# EAGLE design roboskin_distance_IMU_WIFI (EAGLE 9.6.2)
COMPANY: ADAFRUIT INDUSTRIES; DRAWN: KTOWN; REV: B
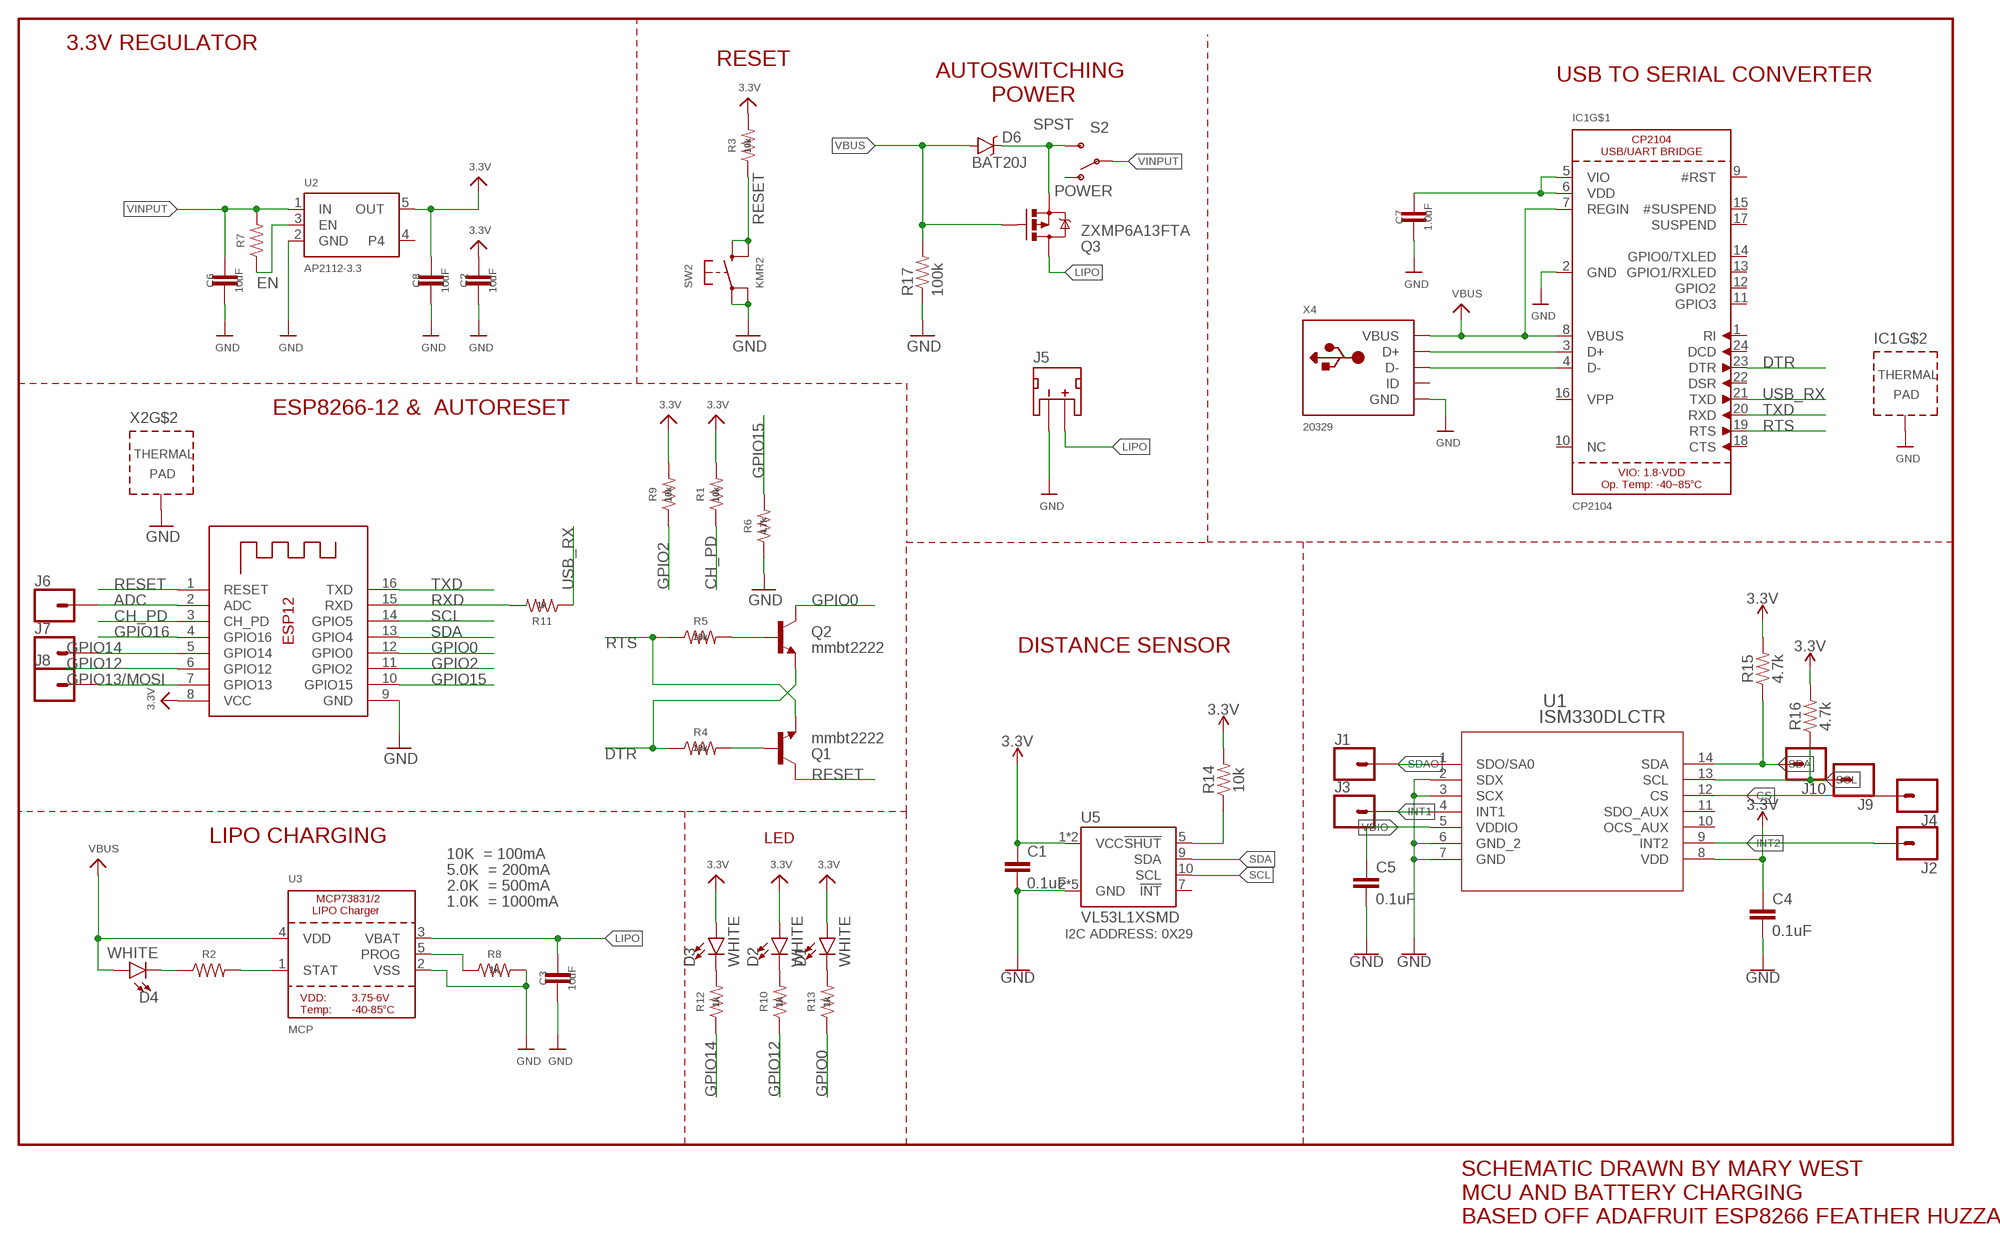
[diagram p0: schematic, sheet 1]

## Parts
C1  0.1uF  0.1UF-0603-25V-(+80/-20%)  [0603]
C2  10uF  10UF-0805-10V-10%  [0805]
C3  10uF  10UF-0805-10V-10%  [0805]
C4  0.1uF  0.1UF-0603-25V-(+80/-20%)  [0603]
C5  0.1uF  0.1UF-0603-25V-(+80/-20%)  [0603]
C6  10uF  10UF-0805-10V-10%  [0805]
C7  1.0uF  1.0UF-0603-16V-10%  [0603]
C8  10uF  10UF-0805-10V-10%  [0805]
D1  WHITE  LED-WHITE1206  [LED-1206]
D2  WHITE  LED-WHITE1206  [LED-1206]
D3  WHITE  LED-WHITE1206  [LED-1206]
D4  WHITE  LED-WHITE1206  [LED-1206]
D6  BAT20J  DIODE-SCHOTTKY-BAT20J  [SOD-323]
IC1  CP2104  [QFN24_4MM_SMSC]
J1  CONN_01  [1X01]
J2  CONN_01  [1X01]
J3  CONN_01  [1X01]
J4  CONN_01  [1X01]
J5  JST_2MM_MALE  [JST-2-SMD]
J6  CONN_01  [1X01]
J7  CONN_01  [1X01]
J8  CONN_01  [1X01]
J9  CONN_01  [1X01]
J10  CONN_01  [1X01]
Q1  mmbt2222  TRANSISTOR_NPNSOT23-3  [SOT23-3]
Q2  mmbt2222  TRANSISTOR_NPNSOT23-3  [SOT23-3]
Q3  ZXMP6A13FTA  MOSFET-PCHANNEL  [SOT23-3]
R1  10k  10KOHM-0603-1/10W-1%  [0603]
R2  1k  1KOHM-0603-1/10W-1%  [0603]
R3  10k  10KOHM-0603-1/10W-1%  [0603]
R4  10k  10KOHM-0603-1/10W-1%  [0603]
R5  10k  10KOHM-0603-1/10W-1%  [0603]
R6  4.7k  4.7KOHM-0603-1/10W-1%  [0603]
R7  10k  10KOHM-0603-1/10W-1%  [0603]
R8  1k  1KOHM-0603-1/10W-1%  [0603]
R9  10k  10KOHM-0603-1/10W-1%  [0603]
R10  1k  1KOHM-0603-1/10W-1%  [0603]
R11  1k  1KOHM-0603-1/10W-1%  [0603]
R12  1k  1KOHM-0603-1/10W-1%  [0603]
R13  1k  1KOHM-0603-1/10W-1%  [0603]
R14  10k  10KOHM-0603-1/10W-1%  [0603]
R15  4.7k  4.7KOHM-0603-1/10W-1%  [0603]
R16  4.7k  4.7KOHM-0603-1/10W-1%  [0603]
R17  100k  100KOHM-1/10W-1%(0603)  [0603-RES]
S2  POWER  SWITCH-SPDT-SMD-A  [SWITCH-SPST-SMD-A]
SW2  KMR2  SWITCH_TACT_SMT4.6X2.8  [BTN_KMR2_4.6X2.8]
U1  ISM330DLCTR  [LGA-14L_2P5X3X0P83_STM]
U2  AP2112-3.3  VREG_SOT23-5  [SOT23-5]
U3  MCP  MCP73831/2  [SOT23-5]
U5  VL53L1XSMD  [VL53L1X]
X2  ESP-12  ESP-12S  [ESP-12S]
X4  20329  USB_MICRO_20329_V2  [4UCONN_20329_V2]

## Nets
3.3V: C1.1 C2.1 C4.1 C8.1 D1.A D2.A D3.A R1.2 R3.2 R9.2 R14.2 R15.2 R16.2 U1.8(VDD) U2.5(OUT) U5.1(VCC) U5.11(VCC) X2.8(VCC)
ADC: J6.1 X2.2(ADC)
CH_PD: R1.1 X2.3(CH_PD)
CS: J4.1 U1.12(CS)
DTR: IC1.23(DTR) Q2.2(E) R4.1
EN: R7.1 U2.3(EN)
GND: C1.2 C2.2 C3.2 C4.2 C5.2 C6.2 C7.2 C8.2 IC1.2(GND) IC1.THERM(TP) J5.1(-) R6.1 R8.2 R17.1 SW2.A'(P1) SW2.A(P) U1.2(SDX) U1.3(SCX) U1.6(GND_2) U1.7(GND) U2.2(GND) U3.2(VSS) U5.2(GND) U5.3(GND) U5.4(GND) U5.6(GND) U5.12(GND) X2.9(GND) X2.P$1(TP) X4.BASE@1(GND) X4.BASE@2(GND) X4.GND X4.SPRT@1(GND) X4.SPRT@2(GND) X4.SPRT@3(GND) X4.SPRT@4(GND)
GPIO0: Q2.3(C) R13.1 X2.12(GPIO0)
GPIO2: R9.1 X2.11(GPIO2)
GPIO12: R10.1 X2.6(GPIO12)
GPIO13/MOSI: J8.1 X2.7(GPIO13)
GPIO14: J7.1 R12.1 X2.5(GPIO14)
GPIO15: R6.2 X2.10(GPIO15)
GPIO16: X2.4(GPIO16)
INMOSFET: D6.C Q3.2(S) S2.3(S)
INT1: J3.1 U1.4(INT1)
INT2: J2.1 U1.9(INT2)
LIPO: C3.1 J5.2(+) Q3.3(D) U3.3(VBAT)
N$1: D4.C R2.1
N$2: IC1.3(D+) X4.D+
N$3: R2.2 U3.1(STAT)
N$4: R8.1 U3.5(PROG)
N$5: D1.C R13.2
N$6: IC1.4(D-) X4.D-
N$7: D2.C R10.2
N$8: C7.1 IC1.5(VIO) IC1.6(VDD)
N$9: D3.C R12.2
N$11: R14.1 U5.5(!SHUT)
N$12: Q1.1(B) R4.2
N$13: Q2.1(B) R5.2
RESET: Q1.3(C) R3.1 SW2.B'(S1) SW2.B(S) X2.1(RESET)
RTS: IC1.19(RTS) Q1.2(E) R5.1
RXD: R11.2 X2.15(RXD)
SCL: J9.1 R16.1 U1.13(SCL) U5.10(SCL) X2.14(GPIO5)
SDA: J10.1 R15.1 U1.14(SDA) U5.9(SDA) X2.13(GPIO4)
SDAO: J1.1 U1.1(SDO/SA0)
TXD: IC1.20(RXD) X2.16(TXD)
USB_RX: IC1.21(TXD) R11.1
VBUS: D4.A D6.A IC1.7(REGIN) IC1.8(VBUS) Q3.1(G) R17.2 U3.4(VDD) X4.VBUS
VDIO: C5.1 U1.5(VDDIO)
VINPUT: C6.1 R7.2 S2.2(P) U2.1(IN)
Unconnected: IC1.1(RI) IC1.9(#RST) IC1.10(NC) IC1.11(GPIO3) IC1.12(GPIO2) IC1.13(GPIO1/RXLED) IC1.14(GPIO0/TXLED) IC1.15(#SUSPEND) IC1.16(VPP) IC1.17(SUSPEND) IC1.18(CTS) IC1.22(DSR) IC1.24(DCD) J5.NC1(PAD1) J5.NC2(PAD2) S2.1(O) U1.10(OCS_AUX) U1.11(SDO_AUX) U2.4 U5.7(!INT) X4.ID

## Notes on the sheet
- 3.3V REGULATOR
- RESET
- AUTOSWITCHING 
  POWER
- USB TO SERIAL CONVERTER
- SPST
- ESP8266-12 &  AUTORESET
- DISTANCE SENSOR
- LIPO CHARGING | LED
- 10K  = 100mA
- 5.0K  = 200mA
- 2.0K  = 500mA
- 1.0K  = 1000mA
- I2C ADDRESS: 0X29
- SCHEMATIC DRAWN BY MARY WEST
  MCU AND BATTERY CHARGING
  BASED OFF ADAFRUIT ESP8266 FEATHER HUZZAH

## Library data of the parts
C1 C4 C5 = SparkFun-Capacitors:0.1UF: 0.1µF ceramic capacitors A capacitor is a passive two-terminal electrical component used to store electrical energy temporarily in an electric field.; PROD_ID: CAP-00810
C2 C3 C6 C8 = SparkFun-Capacitors:10UF: 10.0µF ceramic capacitors A capacitor is a passive two-terminal electrical component used to store electrical energy temporarily in an electric field.; PROD_ID: CAP-11330
C7 = SparkFun-Capacitors:1.0UF: 1µF ceramic capacitors A capacitor is a passive two-terminal electrical component used to store electrical energy temporarily in an electric field.; PROD_ID: CAP-00868
D1-D4 = SparkFun-LED:LED-WHITE: White SMD LED Used in manufacturing several products at SparkFun. Packages: 0603 - Bright White SMD 0603 package[Product Link] <http://www.kingbrightusa.com/product.asp?catalog_name=LED&product_id=APT1608QWF/D> 1206 - Bright White SMD1206 package [Product Link] <http://www.kingbrightusa.com/product.asp?catalog_name=LED&product_id=APT3216QWF/D> 3014 - Super Bright SMD 3014 package [Datasheet] <http://www.lumileds.com/uploads/459/DS208-pdf> SparkFun Products: Blackberry Trackballer Breakout <https://www.sparkfun.com/products/13169> Digital SandBox <https://www.sparkfun.com/products/12651>; PROD_ID: DIO-09955
D6 = SparkFun-DiscreteSemi:DIODE-SCHOTTKY: Schottky diodes in SFE's production catalog BAT20J 1A 23V 0.62Vf RB751 120mA 40V 0.37Vf PMEG4005EJ 0.5A 40V 0.42Vf MBRA140 1A 40V 0.5Vf B340A 3A 40V SMA; PROD_ID: DIO-11623
IC1 = microbuilder:CP2104: CP2104 - USB to UART Bridge VDD Output: 3.45V
J1-J4 J6-J10 = SparkFun-Connectors:CONN_01: Single connection point. Often used as Generic Header-pin footprint for 0.1 inch spaced/style header connections On any of the 0.1 inch spaced packages, you can populate with these: Break Away Headers - Straight <https://www.sparkfun.com/products/116> (PRT-00116) Break Away Male Headers - Right Angle <https://www.sparkfun.com/products/553> (PRT-00553) Female Headers <https://www.sparkfun.com/products/115> (PRT-00115) Break Away Headers - Machine Pin <https://www.sparkfun.com/products/117> (PRT-00117) Break Away Female Headers - Swiss Machine Pin <https://www.sparkfun.com/products/743> (PRT-00743) This device is also useful as a general connection point to wire up your design to another part of your project. Our various solder wires solder well into these plated through hole pads. Hook-Up Wire - Assortment (Stranded, 22 AWG) <https://www.sparkfun.com/products/11375> (PRT-11375) Hook-Up Wire - Assortment (Solid Core, 22 AWG) <https://www.sparkfun.com/products/11367> (PRT-11367) View the entire wire category on our website here <https://www.sparkfun.com/categories/141> Special notes: SMTSO-256-ET is a "flush mount" nut for a 4-40 screw. We mostly use this on specialty testbeds; it is a nice way to connect hardware to your PCB at an adjustable hieght. Also note, the SNAP packages are for using a snappable style connector. We sell a baggie of snaps and they are also used on two LilyPad designs: Snap Assortment - 30 pack (male and female) <https://www.sparkfun.com/products/11347> (DEV-11347) LilyPad Arduino SimpleSnap <https://www.sparkfun.com/products/10941> (DEV-10941) LilyPad SimpleSnap Protoboard <https://www.sparkfun.com/products/10940> (DEV-10940)
J5 = SparkFun-Connectors:JST_2MM_MALE: JST 2MM MALE RA CONNECTOR Two pin, compact surface mount connector. Commonly used as a battery input connection point. We really like the solid locking feeling and high current rating on these small connectors. We use these all the time as battery connectors. Mates to single-cell LiPo batteries. Here is the connector we sell at SparkFun: JST Right Angle Connector - White <https://www.sparkfun.com/products/8612> (PRT-08612) Datasheet <http://www.sparkfun.com/datasheets/Prototyping/Connectors/JST-Horizontal.pdf> It was used on these SparkFun products: SparkFun MOSFET Power Controller <https://www.sparkfun.com/products/11214> (PRT-11214) SparkFun Battery Babysitter - LiPo Battery Manager <https://www.sparkfun.com/products/13777> (PRT-13777) And many, many others that required a lipo battery connection.; PROD_ID: CONN-11443; SF_ID: PRT-08612
Q1 Q2 = SparkFun:TRANSISTOR_NPN: Transistor NPN BJT configuration in SOT23 package. MMBT2222 is the common NPN we use. Double check BCE configuration again layout.
Q3 = SparkFun-DiscreteSemi:MOSFET-PCHANNEL: Generic PMOSFET IRLML2244 - TRANS-11153 (SOT-23 -20V -4.3A) (1.Gate 2.Source 3.Drain) FQP27P06 - COM-10349 <http://www.sparkfun.com/products/10349> (TO-220 -60V -27A) (1.Gate 2.Source 3.Drain); PROD_ID: TRANS-08285
R1 R3-R5 R7 R9 R14 = SparkFun-Resistors:10KOHM: 10kΩ resistor A resistor is a passive two-terminal electrical component that implements electrical resistance as a circuit element. Resistors act to reduce current flow, and, at the same time, act to lower voltage levels within circuits. - Wikipedia; PROD_ID: RES-00824
R2 R8 R10-R13 = SparkFun-Resistors:1KOHM: 1kΩ resistor A resistor is a passive two-terminal electrical component that implements electrical resistance as a circuit element. Resistors act to reduce current flow, and, at the same time, act to lower voltage levels within circuits. - Wikipedia; PROD_ID: RES-07856
R6 R15 R16 = SparkFun-Resistors:4.7KOHM: 4.7kΩ resistor A resistor is a passive two-terminal electrical component that implements electrical resistance as a circuit element. Resistors act to reduce current flow, and, at the same time, act to lower voltage levels within circuits. - Wikipedia; PROD_ID: RES-07857
R17 = SparkFun-Resistors:100KOHM-1/10W-1%(0603): RES-07828; PROD_ID: RES-07828
S2 = SparkFun-Electromechanical:SWITCH-SPDT: SPDT Switch Simple slide switch, Spark Fun Electronics SKU : COM-00102 DPDT SMT slide switch, AYZ0202, SWCH-08179; PROD_ID: SWCH-10651
SW2 = microbuilder:SWITCH_TACT_SMT: SMT Tact Switches 6x6mm - Digikey: P12940SCT-ND KMR2 (4.6x2.8mm) - Digikey: 401-1426-1-ND EVQ-PQHB55 - Light Touch, 160GF (4.5x4.5mm) - Digikey: P8090SCT-ND KMT0 - KMT021 NGJ LHS (etc.) IP68/Waterproof - Digikey: CKN10289CT-ND
U1 = ISM330:ISM330DLCTR; BUILT_BY: EMA_Cory; COPYRIGHT: Copyright (C) 2018 Accelerated Designs. All rights reserved; DATASHEET: https://www.st.com/resource/en/datasheet/ism330dlc.pdf; MANUFACTURER_PART_NUMBER: ISM330DLCTR; SOURCELIBRARY: Update_to_database_2021-06-01; VENDOR: STMicroelectronics
U2 = microbuilder:VREG_SOT23-5: SOT23-5 Fixed Voltage Regulators Part Current Out V Out V In V Dropout θJA (°C/W) TJ (°C) Digikey Part No. ADP121 150mA 3.3V 3.4-5.5V 0.09V @ 150mA -- -- ADP121-AUJZ33R7CT-ND ADP121 150mA 3.0V 3.1-5.5V 0.09V @ 150mA -- -- ADP121-AUJZ30R7CT-ND ADP122 300mA 3.3V 3.4-5.5V 0.085V @ 300mA -- -- ADP122AUJZ-3.3-R7CT-ND ADP1712 300mA 3.3V 3.5-5.5V 0.17V @ 300mA -- -- ADP1712AUJZ-3.3-R7TR-ND AP7311 (Low Cost) 150mA 3.3V 3.5-6V 0.15V @ 150mA -- -- AP7311-33WG-7DICT-ND LD39015M18R 150mA 1.8V 1.9V-5.5V 0.08V @ 100mA -- -- 497-6977-1-ND LP2985A-33DBVR 150mA 3.3V 3.3-16V 0.28V @ 150mA 206 150 296-18479-1-ND MCP1824T-3302E/OT 300mA 3.3V 3.5V-6V 0.2V @ 300mA -- -- MCP1824T-3302E/OTCT-ND MIC5205-2.5YM5 TR 150mA 2.5V 2.7-16V 0.165V @ 150mA -- -- 576-1257-2-ND MIC5205-3.0YM5 TR 150mA 3.0V 3.2V-16V 0.165V @ 150mA -- -- 576-1258-2-ND MIC5205-3.3YM5 TR 150mA 3.3V 3.5V-16V 0.165V @ 150mA -- -- 576-1259-2-ND TPS780330220 150mA 3.3V+2.2V 3.6-5.5V 250mV Max -- -- 296-23332-1-ND TDA3663/N1,135 100mA 3.3V 3.5-45V 0.18V @ 50mA -- -- 568-5343-1-ND Max operating temp can be calculated using θJA, TJ (max junction temperature), and power in watts. Set the "Maximum Ambient Temperature" until it reaches TJ ("Max Junction Temperature"), which is the absolute limit for safe use of the regulator: Heat Sink Temperature Calculator <http://www.daycounter.com/Calculators/Heat-Sink-Temperature-Calculator.phtml> For example, With 12V source into a 3.3V LP2985 and a 30mA load, we are dissipating (12V-3.3V) * 0.03A = 0.261W. With a θJA of 206 °C/W, a TJ of 150°C, and 261mW we can safely use the chip without a heat sink up to 75°C (=147.1°C Junction Temperature).
U3 = microbuilder:MCP73831/2: MCP73831/2 LIPO Charger VDD: 3.75 - 6V Temp -40 - 85°C Programmable Charge Rate: 15-500mA NOTE: STAT is a tri-state logic output on the MCP73831 and an open-drain output on the MCP73832. SOT23-5 with 4.2V output and tri-state logic on STAT = MCP73831T-2ACI/OT
U5 = SparkFun-Sensors:VL53L1X: STMicroelectronics VL53L1X - 400 cm IR Laser ToF Sensor VL53L1X is a state-of-the-art ToF laser-ranging sensor, enhancing the ST FlightSense product family. It is the fastest miniature ToF sensor currently on the market with accurate ranging up to 4 m and fast ranging frequency (up to 50 Hz). Housed in a miniature and reflowable package, it integrates a single photon avalanche diode (SPAD) receiving array, a 940 nm invisible laser Class 1 emitter, physical infrared filters, and optics to achieve the best ranging performance in various ambient lighting conditions with a range of cover window options.; PROD_ID: IC-13960
X2 = microbuilder:ESP-12S
X4 = microbuilder:USB: USB Connectors USBMINIB - Surface Mount Female Mini-B USB Connector 4UConnector: 06564

## Net classes
1 highpower: width 0.406 mm, drill 0.483 mm
2 lowpower: width 0.305 mm, drill 0.483 mm

## Board
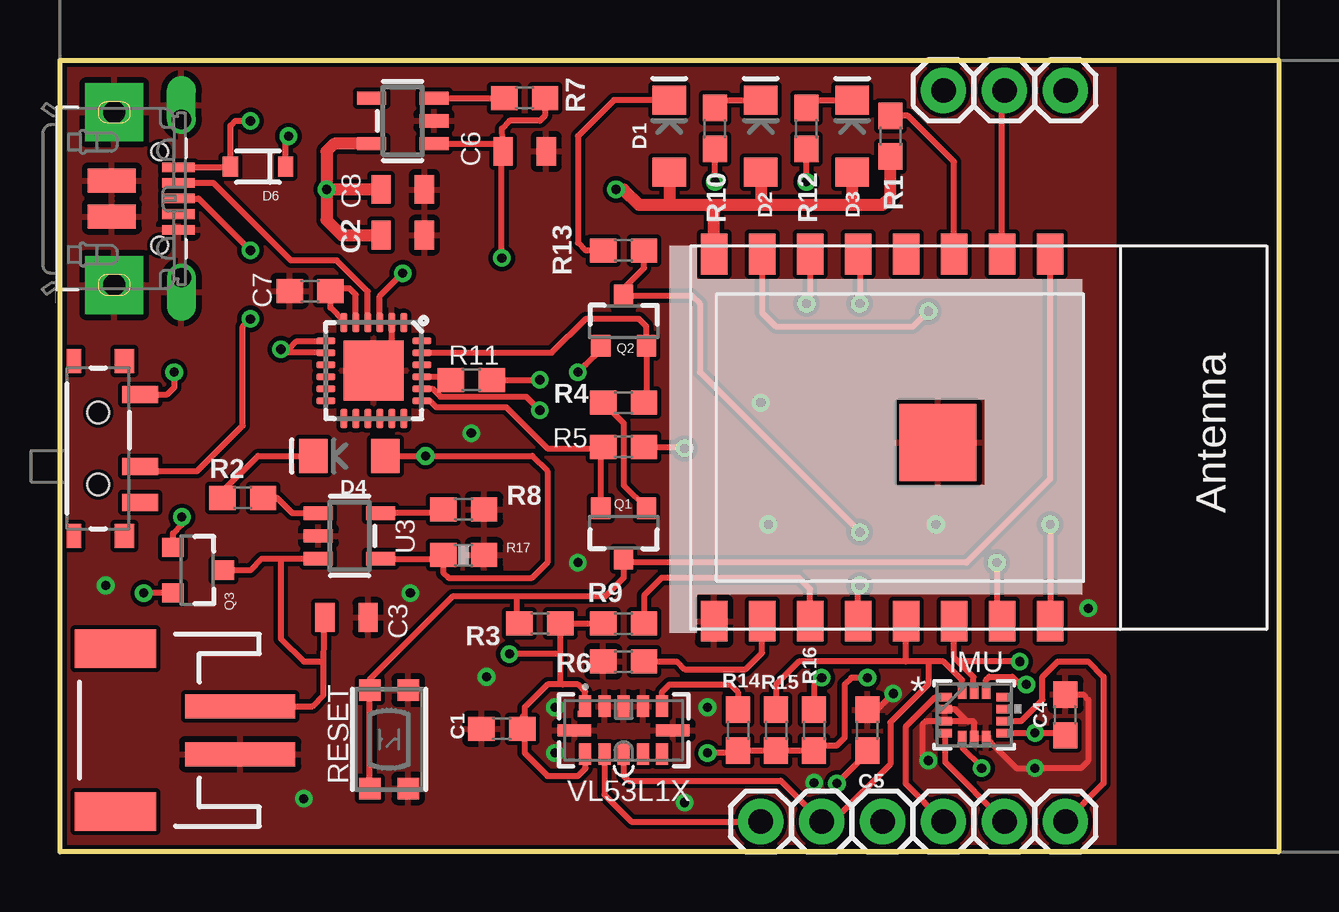
[diagram p1: board, top side]
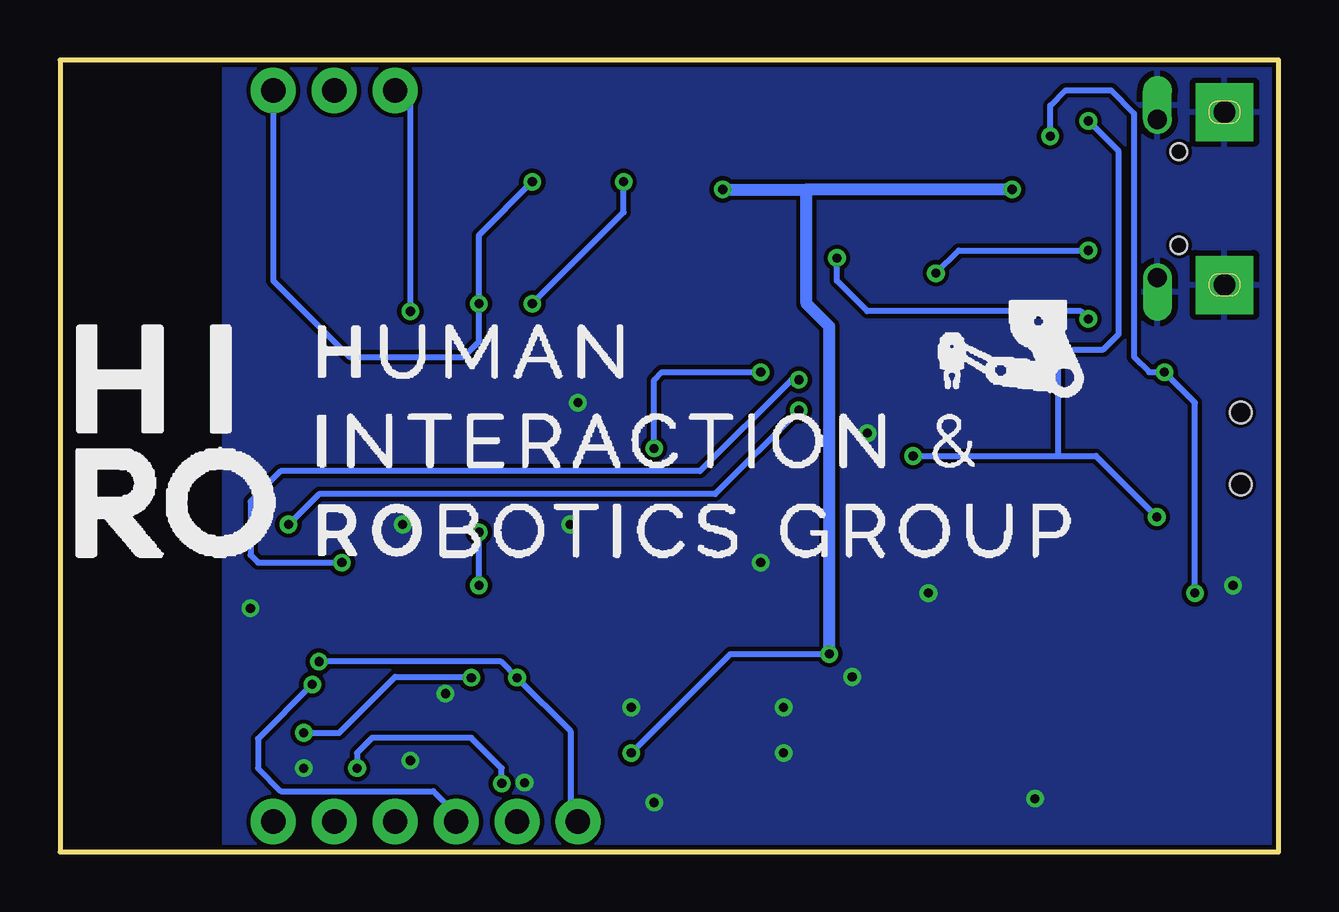
[diagram p2: board, bottom side, seen from below]

Size 50.8 x 33.02 mm. Coordinates in mm from the lower left corner, seen from the top.
Outline: 0,0 0,33.02 50.8,33.02 50.8,0 0,0
Copper layers (1*16): Top 0.035mm / dielectric 1.5mm / Bottom 0.035mm
Design rules "SparkFun-2-layer-TIGHT": minimum track width 7mil, minimum drill 15mil, track to track 7mil, track to pad 7mil, pad to pad 7mil, via to via 7mil, smd to smd 7mil, copper to edge 7mil, drill to drill 7mil, minimum pad ring 7mil, minimum via ring 7mil, stop-mask expansion 4mil, vias tented up to drill 25mil, thermal gap 10mil

### Footprints (pad centres in the part's own frame; a part is rotated, then mirrored left to right if it is on the bottom)
0603 = smd 1.1 x 1: 1 -0.85,0; 2 0.85,0
0805 = smd 0.8 x 1.2: 1 -0.9,0; 2 0.9,0
LED-1206 = smd 1.2 x 1.4: A -1.5,0; C 1.5,0
SOD-323 = smd 0.63 x 0.83: A 1.15,0; C -1.15,0
QFN24_4MM_SMSC = smd 0.8 x 0.28: 1 -2,1.25; 2 -2,0.75; 3 -2,0.25; 4 -2,-0.25; 5 -2,-0.75; 6 -2,-1.25; 13 2,-1.25; 14 2,-0.75; 15 2,-0.25; 16 2,0.25; 17 2,0.75; 18 2,1.25 | smd 0.28 x 0.8: 7 -1.25,-2; 8 -0.75,-2; 9 -0.25,-2; 10 0.25,-2; 11 0.75,-2; 12 1.25,-2; 19 1.25,2; 20 0.75,2; 21 0.25,2; 22 -0.25,2; 23 -0.75,2; 24 -1.25,2 | smd 2.5 x 2.5: THERM 0,0
1X01 = drill 1.016 pad 1.88: 1 0,0
JST-2-SMD = smd 1 x 4.6: 1 -1,-3.7; 2 1,-3.7 | smd 1.6 x 3.4: NC1 -3.4,1.5; NC2 3.4,1.5
SOT23-3 = smd 0.8 x 0.9: 1 -0.95,-1; 2 0.95,-1; 3 0,1.1
0603-RES = smd 1.1 x 1: 1 -0.85,0; 2 0.85,0
SWITCH-SPST-SMD-A = smd 0.7 x 1.5: 1 -2.25,-1.75; 2 -0.75,-1.75; 3 2.25,-1.75 | smd 1 x 0.6: GND1 -3.65,1; GND3 3.65,1 | smd 1 x 0.8: GND2 -3.65,-1.1; GND4 3.65,-1.1 | hole 0.9: -1.5,0; 1.5,0
BTN_KMR2_4.6X2.8 = smd 0.9 x 0.9: A 2.05,0.8; A' -2.05,0.8; B 2.05,-0.8; B' -2.05,-0.8
LGA-14L_2P5X3X0P83_STM = smd 0.577 x 0.352: 1 -1.21,0.75; 2 -1.21,0.25; 3 -1.21,-0.25; 4 -1.21,-0.75; 8 1.21,-0.75; 9 1.21,-0.25; 10 1.21,0.25; 11 1.21,0.75 | smd 0.352 x 0.577: 5 -0.5,-0.956; 6 0,-0.956; 7 0.5,-0.956; 12 0.5,0.956; 13 0,0.956; 14 -0.5,0.956
SOT23-5 = smd 0.55 x 1.2: 1 -0.95,-1.3; 2 0,-1.3; 3 0.95,-1.3; 4 0.95,1.3; 5 -0.95,1.3
VL53L1X = smd 0.5 x 0.9: 1 1.6,-1; 2 0.8,-1; 3 0,-1; 4 -0.8,-1; 5 -1.6,-1; 7 -1.6,1; 8 -0.8,1; 9 0,1; 10 0.8,1; 11 1.6,1 | smd 1.4 x 0.5: 6 -2.05,0; 12 2.05,0
ESP-12S = smd 1.7 x 1.1: 1 -7.65,5.77; 2 -7.65,3.77; 3 -7.65,1.77; 4 -7.65,-0.23; 5 -7.65,-2.23; 6 -7.65,-4.23; 7 -7.65,-6.23; 8 -7.65,-8.23; 9 7.65,-8.23; 10 7.65,-6.23; 11 7.65,-4.23; 12 7.65,-2.23; 13 7.65,-0.23; 14 7.65,1.77; 15 7.65,3.77; 16 7.65,5.77 | smd 3.2 x 3.2: P$1 0.2,1.1
4UCONN_20329_V2 = smd 1 x 2: BASE@1 -0.75,-2; BASE@2 0.75,-2 | smd 0.4 x 1.35: D+ 0,0.775; D- -0.65,0.775; GND 1.3,0.775; ID 0.65,0.775; VBUS -1.3,0.775 | drill 0.8 pad 1.143 offset: SPRT@1 -3.3,0.9; SPRT@2 3.3,0.9 | drill 0.9 pad 2.413 square: SPRT@3 -3.6,-1.9; SPRT@4 3.6,-1.9 | hole 0.7: -1.95,0; 1.95,0

### Placement (x,y rotation side)
C1  18.41,5.14 180 top
C2  14.29,25.72 0 top
C3  11.94,9.78 0 top
C4  41.91,5.71 90 top
C5  33.66,5.08 90 top
C6  19.37,29.21 0 top
C7  10.43,23.39 180 top
C8  14.29,27.62 0 top
D1  25.4,29.84 90 top
D2  29.21,29.84 90 top
D3  33.02,29.84 90 top
D4  12.07,16.51 180 top
D6  8.25,28.57 180 top
IC1  13.08,20.07 270 top
J1  36.83,1.27 0 top
J2  41.91,1.27 0 top
J3  39.37,1.27 0 top
J4  34.29,1.27 0 top
J5  3.81,5.08 90 top
J6  39.37,31.75 0 top
J7  41.91,31.75 0 top
J8  36.83,31.75 0 top
J9  29.21,1.27 0 top
J10  31.75,1.27 0 top
Q1  23.5,13.34 180 top
Q2  23.5,22.1 0 top
Q3  5.72,11.75 270 top
R1  34.61,29.84 270 top
R2  7.62,14.76 0 top
R3  20,9.53 0 top
R4  23.5,18.73 180 top
R5  23.5,16.89 0 top
R6  23.5,7.94 0 top
R7  19.37,31.43 0 top
R8  16.83,14.29 0 top
R9  23.5,9.53 180 top
R10  27.3,30.16 90 top
R11  17.14,19.68 0 top
R12  31.12,30.16 90 top
R13  23.5,25.08 180 top
R14  28.26,5.08 270 top
R15  29.84,5.08 270 top
R16  31.43,5.08 270 top
R17  16.83,12.38 180 top
S2  1.59,16.83 90 top
SW2  13.72,4.7 270 top
U1  38.1,5.71 0 top
U2  14.29,30.48 90 top
U3  12.07,13.18 270 top
U5  23.5,5.08 180 top
U$6  [HIRO_GRAPHICS#PNG]  29.53,17.14 0 bottom
X2  35.5,17.27 270 top
X4  4.16,27.24 270 top

### Tracks (layer width: path | path; a pad name or v marks a point on that pad's centre or on a via)
3.3V  (via drill 0.38)
  Top 0.254: U1.8 v40.64,4.96 41.81,4.96 C4.1 | v26.99,4.13 28.16,4.13 R14.2 R15.2 R16.2 31.65,4.45 32.38,4.45 32.7,4.76 32.7,6.99 32.98,7.26 v33.66,7.26 | 20.85,8.26 v18.73,8.26 | U5.1 21.89,6.68 21.59,6.99 20.96,6.99 | 20.96,6.99 20.32,6.99 19.37,6.03 19.37,5.71 | 19.37,5.71 19.37,4.13 20.32,3.18 21.59,3.18 21.91,3.49 21.91,4.07 U5.11 | C1.1 19.27,5.61 19.37,5.71 | 20.96,6.99 20.85,7.09 20.85,8.26 | R9.2 R3.2 20.85,8.26
  Top 0.508: U2.5 11.43,29.53 11.11,29.21 v11.11,27.62 | v11.11,27.62 11.11,26.35 11.75,25.72 C2.1 | C8.1 v11.11,27.62 | v23.18,27.62 23.5,27.62 24.13,26.99 25.4,26.99 | R1.2 34.61,27.3 34.29,26.99 33.02,26.99 | 25.4,26.99 26.99,26.99 | 26.99,26.99 29.21,26.99 | 29.21,26.99 33.02,26.99 | D1.A 25.4,26.99 | D2.A 29.21,26.99 | D3.A 33.02,26.99 | X2.8 27.27,26.71 26.99,26.99
  Bottom 0.254: v26.99,4.13 22.86,8.26 v18.73,8.26 | v40.64,4.96 39.17,4.96 36.83,7.3 33.66,7.3 v33.66,7.26
  Bottom 0.508: v11.11,27.62 19.69,27.62 | v23.18,27.62 19.69,27.62 | 19.69,27.62 19.69,22.86 18.73,21.91 v18.73,8.26
ADC
  Top 0.254: X2.2 39.27,31.65 J6.1
CH_PD
  Top 0.254: X2.3 37.27,28.77 35.34,30.7 R1.1
CS  (via drill 0.38)
  Top 0.254: U1.12 38.6,7.17 38.73,7.3 39.69,7.3 40.01,6.99 v40.28,6.99
  Bottom 0.254: J4.1 34.29,1.59 35.24,2.54 41.59,2.54 42.55,3.49 42.55,4.72 v40.28,6.99
DTR
  Top 0.254: IC1.23 20.5,20.82 21.91,22.23 24.13,22.23 24.45,21.91 Q2.2 24.45,18.83 R4.1
EN
  Top 0.254: U2.3 R7.1
GND  (via drill 0.38)
  Top 0.254: IC1.2 13.83,20.82 IC1.THERM | U1.6 38.1,5.4 38.03,5.46 37.78,5.46 | U1.7 39.87,3.49 v40.64,3.49 42.55,3.49 42.86,3.81 42.86,6.35 42.65,6.56 C4.2 | v36.2,3.81 35.96,4.05 35.96,5.32 36.09,5.45 36.87,5.45 U1.3 37.78,5.46 | U1.2 37.28,5.96 37.78,5.46 | C5.2 34.06,5.93 v34.73,6.6
  other vias: 17.78,7.3 20.64,4.13 17.14,17.46 1.91,11.11 42.86,10.16 29.21,18.73 10.16,2.22 26.99,6.03 36.51,13.65 29.53,13.65 14.61,10.79 21.59,12.07 31.43,2.89 20.64,6.03 26.04,2.06
  pour Top: 0,0 43.97,0 43.97,33.02 0,33.02
  pour Bottom: 0,0 0,33.02 43.97,33.02 43.97,0
GPIO0  (via drill 0.38)
  Top 0.254: R13.1 24.35,24.34 23.5,23.5 Q2.3 26.33,23.2 26.67,22.86 26.67,20 v33.34,13.34 | X2.12 33.27,11.04 v33.34,11.11
  Bottom 0.254: v33.34,11.11 v33.34,13.34
GPIO2
  Top 0.254: X2.11 31.27,10.96 30.8,11.43 25.08,11.43 24.35,10.69 R9.1
GPIO12  (via drill 0.38)
  Top 0.254: X2.6 31.27,23.01 v31.12,22.86 | v27.3,27.94 R10.1
  Bottom 0.254: v31.12,22.86 27.3,26.67 v27.3,27.94
GPIO13/MOSI  (via drill 0.38)
  Top 0.254: X2.7 29.27,22.49 29.84,21.91 35.56,21.91 v36.2,22.54
  Bottom 0.254: v36.2,22.54 36.2,31.11 J8.1
GPIO14  (via drill 0.38)
  Top 0.254: X2.5 33.34,24.85 v33.34,22.86 | v31.12,27.94 R12.1
  Bottom 0.254: v31.12,27.94 33.34,25.72 v33.34,22.86 33.34,21.27 33.97,20.64 38.73,20.64 41.91,23.81 J7.1
GPIO15
  Top 0.254: R6.2 25.72,7.94 26.04,7.62 28.57,7.62 29.27,8.31 X2.10
INMOSFET  (via drill 0.38)
  Top 0.254: v4.76,20 4.76,19.37 4.47,19.08 S2.3 | Q3.2 v3.49,10.79 | D6.C 9.41,29.73 v9.52,29.84
  Bottom 0.254: v3.49,10.79 3.49,18.73 v4.76,20 5.4,20 6.03,20.64 6.03,30.8 6.99,31.75 8.89,31.75 9.52,31.11 v9.52,29.84
INT1
  Top 0.254: U1.4 36.89,3.75 J3.1
INT2
  Top 0.254: U1.9 40.07,5.46 40.96,6.35 40.96,7.3 41.59,7.94 42.86,7.94 43.5,7.3 43.5,2.86 J2.1
LIPO
  Top 0.254: J5.2 10.52,6.08 10.99,6.54 10.99,7.94 | 10.99,7.94 C3.1 | U3.3 9.21,12.23 | 9.21,12.23 8.42,12.23 7.94,11.75 Q3.3 | 9.21,12.23 9.21,8.89 10.16,7.94 10.99,7.94
N$1
  Top 0.254: D4.C 8.25,16.51 6.77,15.03 R2.1
N$2  (via drill 0.38)
  Top 0.254: IC1.3 13.33,23.17 v14.29,24.13 | X4.D+ 5.78,27.24 v7.94,25.08
  Bottom 0.254: v14.29,24.13 13.34,25.08 v7.94,25.08
N$3
  Top 0.254: U3.1 9.69,14.13 9.05,14.76 R2.2
N$4
  Top 0.254: R8.1 15.82,14.13 U3.5
N$5
  Top 0.254: D1.C 23.09,31.35 21.59,29.84 21.59,25.4 21.91,25.08 R13.2
N$6
  Top 0.254: X4.D- 6.4,27.89 9.63,24.66 11.53,24.66 12.83,23.36 IC1.4
N$7
  Top 0.254: R10.2 27.64,31.35 D2.C
N$8
  Top 0.254: IC1.5 12.33,23.23 12.07,23.5 11.39,23.5 C7.1 11.28,22.7 11.83,22.14 IC1.6
N$9
  Top 0.254: R12.2 31.45,31.35 D3.C
N$11
  Top 0.254: U5.5 25.1,6.68 25.4,6.99 27.94,6.99 28.26,6.67 R14.1
N$12
  Top 0.254: R4.2 23.5,17.88 23.5,15.29 Q1.1
N$13  (via drill 0.38)
  Top 0.254: Q2.1 22.55,20.96 21.91,20.32 v21.59,20 | R5.2 25.97,16.89 v26.04,16.83
  Bottom 0.254: v26.04,16.83 26.04,19.68 25.72,20 v21.59,20
RESET
  Top 0.254: 19.05,10.65 22.71,10.65 23.5,11.43 23.5,12.07 | 19.05,10.65 16.36,10.65 12.92,7.2 SW2.B' SW2.B | Q1.3 23.5,12.07 | X2.1 41.27,15.55 37.78,12.07 23.5,12.07 | R3.1 19.05,9.63 19.05,10.65
RTS
  Top 0.254: IC1.19 15.41,18.82 15.68,18.55 18.6,18.55 20.32,16.83 22.58,16.83 R5.1 22.55,16.79 Q1.2
RXD  (via drill 0.38)
  Top 0.254: R11.2 v20,19.68 | v39.05,12.07 39.05,9.84 X2.15
  Bottom 0.254: v20,19.68 20.32,19.68 24.13,15.88 41.59,15.88 42.86,14.61 42.86,12.38 42.55,12.07 v39.05,12.07
SCL  (via drill 0.38)
  Top 0.254: U1.13 38.08,6.69 38.08,7.3 37.45,7.93 | 37.45,7.93 37.27,8.11 X2.14 | v40.01,7.94 37.47,7.94 37.45,7.93 | v31.75,7.26 31.43,6.95 R16.1 | U5.10 22.7,2.39 23.81,1.27 J9.1
  Bottom 0.254: v40.01,7.94 32.42,7.94 v31.75,7.26 29.53,5.04 29.53,1.59 J9.1
SDA
  Top 0.254: 35.27,9.01 X2.13 35.24,9.6 35.24,7.94 | 35.24,7.94 30.8,7.94 29.84,6.99 R15.1 | U1.14 37.6,7.17 36.83,7.94 36.2,7.94 | 36.2,7.94 35.24,7.94 | U5.9 23.5,3.18 23.7,2.97 30.05,2.97 31.59,1.43 | 31.59,1.43 J10.1 | 36.2,7.94 36.2,6.99 34.61,5.4 34.61,3.66 32.37,1.43 31.59,1.43
SDAO
  Top 0.254: U1.1 36.87,6.45 36.48,6.45 35.24,5.21 35.24,2.86 J1.1
TXD  (via drill 0.38)
  Top 0.254: IC1.20 15.52,19.32 15.86,18.98 19.44,18.98 v20,18.41 | v41.27,13.65 X2.16
  Bottom 0.254: v20,18.41 23.5,14.92 40.01,14.92 v41.27,13.65
USB_RX
  Top 0.254: IC1.21 16.25,19.82 R11.1
VBUS  (via drill 0.38)
  Top 0.254: U3.4 15.82,12.23 R17.2 15.98,11.64 16.19,11.43 19.69,11.43 20.32,12.07 20.32,15.88 19.69,16.51 v15.24,16.51 D4.A | X4.VBUS 7.07,28.54 D6.A 7.1,30.28 7.3,30.48 v7.94,30.48 | IC1.7 11.04,21.27 9.84,21.27 9.52,20.96 v9.21,20.96 9.35,20.82 IC1.8 | Q3.1 4.71,13.29 5.08,13.65 v5.08,13.97
  Bottom 0.254: v5.08,13.97 7.62,16.51 9.21,16.51 | v15.24,16.51 9.21,16.51 | 9.21,16.51 v9.21,20.96 7.3,20.96 6.67,21.59 6.67,29.21 v7.94,30.48
VDIO  (via drill 0.38)
  Top 0.254: U1.5 37.62,4.74 37.62,4.34 38.42,3.55 v38.42,3.49 | C5.1 33.66,4.13 v32.38,2.86
  Bottom 0.254: v32.38,2.86 32.38,3.49 33.66,4.76 37.78,4.76 38.42,4.13 v38.42,3.49
VINPUT  (via drill 0.38)
  Top 0.254: U2.1 18.1,29.53 C6.1 | R7.2 20.22,30.7 20,30.48 18.73,30.48 18.42,30.16 C6.1 | S2.2 3.54,15.88 5.72,15.88 7.62,17.78 7.62,21.91 v7.94,22.23 | v18.41,24.77 18.41,29.21 C6.1
  Bottom 0.254: v7.94,22.23 8.25,22.54 17.14,22.54 18.41,23.81 v18.41,24.77

### Text on the board
tPlace: IMU | RESET | VL53L1X